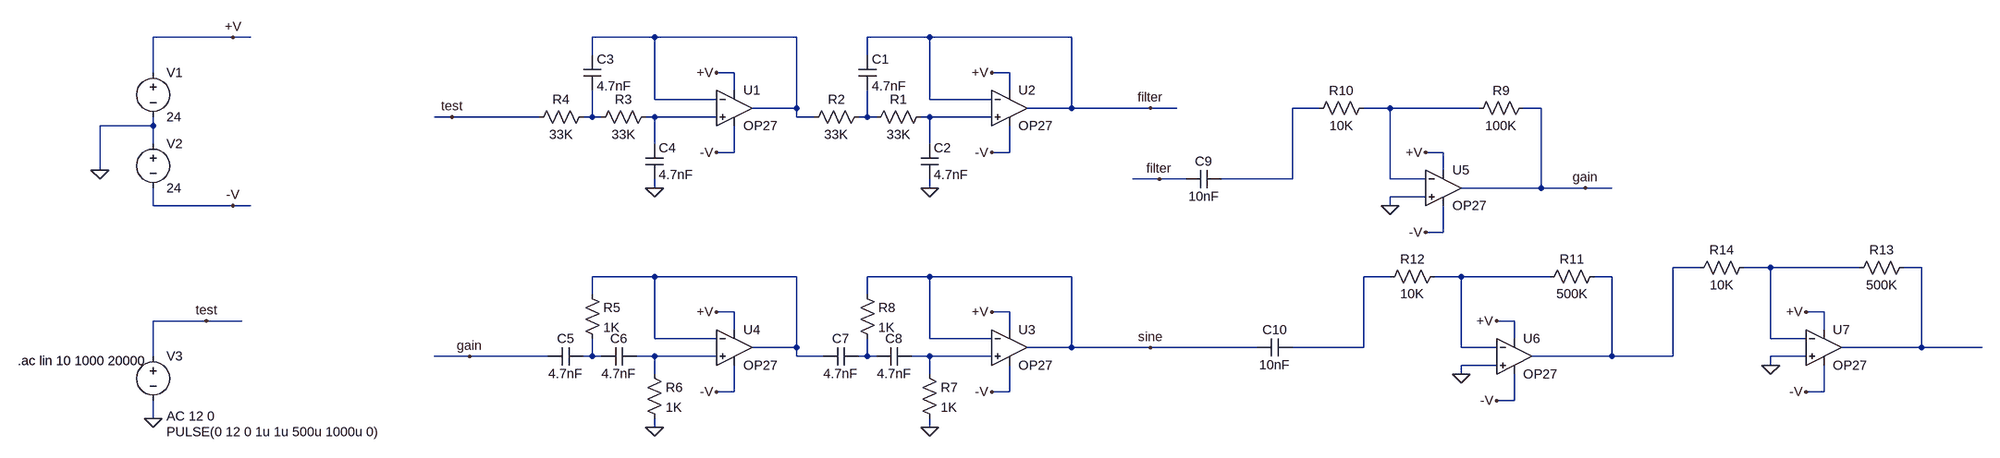
[diagram p0: schematic filter_back_to_back.asc]
filter_back_to_back.asc, the LTspice schematic file:
Version 4
SHEET 1 2404 680
WIRE -944 -192 -1088 -192
WIRE -912 -192 -944 -192
WIRE -64 -192 -176 -192
WIRE 192 -192 -64 -192
WIRE 432 -192 320 -192
WIRE 688 -192 432 -192
WIRE -176 -160 -176 -192
WIRE 320 -160 320 -192
WIRE -1088 -128 -1088 -192
WIRE 80 -128 48 -128
WIRE 576 -128 544 -128
WIRE 80 -96 80 -128
WIRE 576 -96 576 -128
WIRE -64 -80 -64 -192
WIRE 48 -80 -64 -80
WIRE 432 -80 432 -192
WIRE 544 -80 432 -80
WIRE 192 -64 192 -192
WIRE 192 -64 112 -64
WIRE 688 -64 688 -192
WIRE 688 -64 608 -64
WIRE 832 -64 688 -64
WIRE 880 -64 832 -64
WIRE 1136 -64 1088 -64
WIRE 1264 -64 1216 -64
WIRE 1424 -64 1264 -64
WIRE 1536 -64 1504 -64
WIRE -496 -48 -528 -48
WIRE -272 -48 -496 -48
WIRE -176 -48 -176 -96
WIRE -176 -48 -192 -48
WIRE -160 -48 -176 -48
WIRE -64 -48 -80 -48
WIRE 48 -48 -64 -48
WIRE 192 -48 192 -64
WIRE 224 -48 192 -48
WIRE 320 -48 320 -96
WIRE 320 -48 304 -48
WIRE 336 -48 320 -48
WIRE 432 -48 416 -48
WIRE 544 -48 432 -48
WIRE -1088 -32 -1088 -48
WIRE -1088 -32 -1184 -32
WIRE -1088 0 -1088 -32
WIRE -64 0 -64 -48
WIRE 432 0 432 -48
WIRE 80 16 80 -32
WIRE 80 16 48 16
WIRE 576 16 576 -32
WIRE 576 16 544 16
WIRE 1360 16 1328 16
WIRE -1184 48 -1184 -32
WIRE 1360 48 1360 16
WIRE 848 64 800 64
WIRE 896 64 848 64
WIRE 1088 64 1088 -64
WIRE 1088 64 960 64
WIRE 1264 64 1264 -64
WIRE 1328 64 1264 64
WIRE -64 80 -64 64
WIRE 432 80 432 64
WIRE 1536 80 1536 -64
WIRE 1536 80 1392 80
WIRE 1616 80 1536 80
WIRE 1664 80 1616 80
WIRE 1328 96 1264 96
WIRE -1088 112 -1088 80
WIRE -944 112 -1088 112
WIRE -912 112 -944 112
WIRE 1264 112 1264 96
WIRE 1360 160 1360 112
WIRE 1360 160 1328 160
WIRE 1872 224 1824 224
WIRE 2000 224 1952 224
WIRE 2160 224 2000 224
WIRE 2272 224 2240 224
WIRE -64 240 -176 240
WIRE 192 240 -64 240
WIRE 432 240 320 240
WIRE 688 240 432 240
WIRE 1264 240 1216 240
WIRE 1392 240 1344 240
WIRE 1552 240 1392 240
WIRE 1664 240 1632 240
WIRE -176 272 -176 240
WIRE 320 272 320 240
WIRE 80 304 48 304
WIRE 576 304 544 304
WIRE 2096 304 2064 304
WIRE -992 320 -1088 320
WIRE -928 320 -992 320
WIRE 1488 320 1456 320
WIRE 80 336 80 304
WIRE 576 336 576 304
WIRE 2096 336 2096 304
WIRE -64 352 -64 240
WIRE 48 352 -64 352
WIRE 432 352 432 240
WIRE 544 352 432 352
WIRE 1488 352 1488 320
WIRE 2000 352 2000 224
WIRE 2064 352 2000 352
WIRE 192 368 192 240
WIRE 192 368 112 368
WIRE 688 368 688 240
WIRE 688 368 608 368
WIRE 832 368 688 368
WIRE 1024 368 832 368
WIRE 1216 368 1216 240
WIRE 1216 368 1088 368
WIRE 1392 368 1392 240
WIRE 1456 368 1392 368
WIRE 2272 368 2272 224
WIRE 2272 368 2128 368
WIRE 2400 368 2272 368
WIRE -1088 384 -1088 320
WIRE -464 384 -528 384
WIRE -256 384 -464 384
WIRE -176 384 -176 352
WIRE -176 384 -192 384
WIRE -160 384 -176 384
WIRE -64 384 -96 384
WIRE 48 384 -64 384
WIRE 192 384 192 368
WIRE 240 384 192 384
WIRE 320 384 320 352
WIRE 320 384 304 384
WIRE 336 384 320 384
WIRE 432 384 400 384
WIRE 544 384 432 384
WIRE 1664 384 1664 240
WIRE 1664 384 1520 384
WIRE 1824 384 1824 224
WIRE 1824 384 1664 384
WIRE 2064 384 2000 384
WIRE 1456 400 1392 400
WIRE 2000 400 2000 384
WIRE -64 416 -64 384
WIRE 432 416 432 384
WIRE 1392 416 1392 400
WIRE 80 448 80 400
WIRE 80 448 48 448
WIRE 576 448 576 400
WIRE 576 448 544 448
WIRE 2096 448 2096 400
WIRE 2096 448 2064 448
WIRE 1488 464 1488 416
WIRE 1488 464 1456 464
WIRE -1088 496 -1088 464
WIRE -64 512 -64 496
WIRE 432 512 432 496
FLAG 544 -128 +V
FLAG 544 16 -V
FLAG 432 80 0
FLAG 48 -128 +V
FLAG 48 16 -V
FLAG -64 80 0
FLAG -1184 48 0
FLAG -944 -192 +V
FLAG -944 112 -V
FLAG -1088 496 0
FLAG -992 320 test
FLAG -496 -48 test
FLAG 832 -64 filter
FLAG 544 304 +V
FLAG 544 448 -V
FLAG 432 512 0
FLAG 48 304 +V
FLAG 48 448 -V
FLAG -64 512 0
FLAG 832 368 sine
FLAG 1328 16 +V
FLAG 1328 160 -V
FLAG 1616 80 gain
FLAG 1264 112 0
FLAG -464 384 gain
FLAG 848 64 filter
FLAG 1456 320 +V
FLAG 1456 464 -V
FLAG 1392 416 0
FLAG 2064 304 +V
FLAG 2064 448 -V
FLAG 2000 400 0
SYMBOL Opamps\\OP27 576 -128 R0
SYMATTR InstName U2
SYMBOL res 432 -64 R90
WINDOW 0 0 56 VBottom 2
WINDOW 3 32 56 VTop 2
SYMATTR InstName R1
SYMATTR Value 33K
SYMBOL res 320 -64 R90
WINDOW 0 0 56 VBottom 2
WINDOW 3 32 56 VTop 2
SYMATTR InstName R2
SYMATTR Value 33K
SYMBOL cap 304 -160 R0
SYMATTR InstName C1
SYMATTR Value 4.7nF
SYMBOL cap 416 0 R0
SYMATTR InstName C2
SYMATTR Value 4.7nF
SYMBOL Opamps\\OP27 80 -128 R0
SYMATTR InstName U1
SYMBOL res -64 -64 R90
WINDOW 0 0 56 VBottom 2
WINDOW 3 32 56 VTop 2
SYMATTR InstName R3
SYMATTR Value 33K
SYMBOL res -176 -64 R90
WINDOW 0 0 56 VBottom 2
WINDOW 3 32 56 VTop 2
SYMATTR InstName R4
SYMATTR Value 33K
SYMBOL cap -192 -160 R0
SYMATTR InstName C3
SYMATTR Value 4.7nF
SYMBOL cap -80 0 R0
SYMATTR InstName C4
SYMATTR Value 4.7nF
SYMBOL voltage -1088 -144 R0
WINDOW 123 0 0 Left 2
WINDOW 39 0 0 Left 2
SYMATTR InstName V1
SYMATTR Value 24
SYMBOL voltage -1088 -16 R0
WINDOW 123 0 0 Left 2
WINDOW 39 0 0 Left 2
SYMATTR InstName V2
SYMATTR Value 24
SYMBOL Opamps\\OP27 576 304 R0
SYMATTR InstName U3
SYMBOL Opamps\\OP27 80 304 R0
SYMATTR InstName U4
SYMBOL res -192 256 R0
SYMATTR InstName R5
SYMATTR Value 1K
SYMBOL res -80 400 R0
SYMATTR InstName R6
SYMATTR Value 1K
SYMBOL res 416 400 R0
SYMATTR InstName R7
SYMATTR Value 1K
SYMBOL res 304 256 R0
SYMATTR InstName R8
SYMATTR Value 1K
SYMBOL cap -192 368 R90
WINDOW 0 0 32 VBottom 2
WINDOW 3 32 32 VTop 2
SYMATTR InstName C5
SYMATTR Value 4.7nF
SYMBOL cap -96 368 R90
WINDOW 0 0 32 VBottom 2
WINDOW 3 32 32 VTop 2
SYMATTR InstName C6
SYMATTR Value 4.7nF
SYMBOL cap 304 368 R90
WINDOW 0 0 32 VBottom 2
WINDOW 3 32 32 VTop 2
SYMATTR InstName C7
SYMATTR Value 4.7nF
SYMBOL cap 400 368 R90
WINDOW 0 0 32 VBottom 2
WINDOW 3 32 32 VTop 2
SYMATTR InstName C8
SYMATTR Value 4.7nF
SYMBOL voltage -1088 368 R0
WINDOW 3 24 152 Left 2
WINDOW 123 24 124 Left 2
WINDOW 39 0 0 Left 2
SYMATTR InstName V3
SYMATTR Value PULSE(0 12 0 1u 1u 500u 1000u 0)
SYMATTR Value2 AC 12 0
SYMBOL Opamps\\OP27 1360 16 R0
SYMATTR InstName U5
SYMBOL res 1520 -80 R90
WINDOW 0 0 56 VBottom 2
WINDOW 3 32 56 VTop 2
SYMATTR InstName R9
SYMATTR Value 100K
SYMBOL res 1232 -80 R90
WINDOW 0 0 56 VBottom 2
WINDOW 3 32 56 VTop 2
SYMATTR InstName R10
SYMATTR Value 10K
SYMBOL cap 960 48 R90
WINDOW 0 0 32 VBottom 2
WINDOW 3 32 32 VTop 2
SYMATTR InstName C9
SYMATTR Value 10nF
SYMBOL Opamps\\OP27 1488 320 R0
SYMATTR InstName U6
SYMBOL res 1648 224 R90
WINDOW 0 0 56 VBottom 2
WINDOW 3 32 56 VTop 2
SYMATTR InstName R11
SYMATTR Value 500K
SYMBOL res 1360 224 R90
WINDOW 0 0 56 VBottom 2
WINDOW 3 32 56 VTop 2
SYMATTR InstName R12
SYMATTR Value 10K
SYMBOL cap 1088 352 R90
WINDOW 0 0 32 VBottom 2
WINDOW 3 32 32 VTop 2
SYMATTR InstName C10
SYMATTR Value 10nF
SYMBOL Opamps\\OP27 2096 304 R0
SYMATTR InstName U7
SYMBOL res 2256 208 R90
WINDOW 0 0 56 VBottom 2
WINDOW 3 32 56 VTop 2
SYMATTR InstName R13
SYMATTR Value 500K
SYMBOL res 1968 208 R90
WINDOW 0 0 56 VBottom 2
WINDOW 3 32 56 VTop 2
SYMATTR InstName R14
SYMATTR Value 10K
TEXT -1332 392 Left 2 !.ac lin 10 1000 20000

The netlist it stands for:
* filter_back_to_back.asc
XU2 N007 filter +V -V filter OP27  ; pins In+ In- V+ V- OUT
R1 N007 N006 33K
R2 N006 N001 33K
C1 filter N006 4.7nF
C2 N007 0 4.7nF
XU1 N005 N001 +V -V N001 OP27  ; pins In+ In- V+ V- OUT
R3 N005 N004 33K
R4 N004 test 33K
C3 N001 N004 4.7nF
C4 N005 0 4.7nF
V1 +V 0 24
V2 0 -V 24
XU3 N017 sine +V -V sine OP27  ; pins In+ In- V+ V- OUT
XU4 N015 N011 +V -V N011 OP27  ; pins In+ In- V+ V- OUT
R5 N011 N014 1K
R6 N015 0 1K
R7 N017 0 1K
R8 sine N016 1K
C5 N014 gain 4.7nF
C6 N015 N014 4.7nF
C7 N016 N011 4.7nF
C8 N017 N016 4.7nF
V3 test 0 PULSE(0 12 0 1u 1u 500u 1000u 0) AC 12 0
XU5 0 N003 +V -V gain OP27  ; pins In+ In- V+ V- OUT
R9 gain N003 100K
R10 N003 N002 10K
C9 N002 filter 10nF
XU6 0 N013 +V -V N008 OP27  ; pins In+ In- V+ V- OUT
R11 N008 N013 500K
R12 N013 N012 10K
C10 N012 sine 10nF
XU7 0 N009 +V -V N010 OP27  ; pins In+ In- V+ V- OUT
R13 N010 N009 500K
R14 N009 N008 10K
.ac lin 10 1000 20000
.lib ADI.lib
.backanno
.end